# EAGLE schematic AA battery connector (EAGLE 7.5.0)
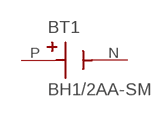
[diagram p0: schematic, sheet 1]

## Parts
BT1  BH1/2AA-SM  [BAT_BH1/2AA-SM]
Unconnected: BT1.N(-) BT1.P(+)

## Library data of the parts
BT1 = BH1_2AA-SM:BH1/2AA-SM: 1/2AA Battery Holder Check prices <https://pricing.snapeda.com/parts/BH1/2AA-SM/MPD/view-part?ref=eda>; AVAILABILITY: Warning; DESCRIPTION: BATTERY HOLDER 1/2 AA SMD TAB; MF: MPD; MP: BH1/2AA-SM; PACKAGE: None; PRICE: None; PURCHASE-URL: https://pricing.snapeda.com/search/part/BH1/2AA-SM/?ref=eda